# Altium schematic sheet Control.SchDoc
size A4
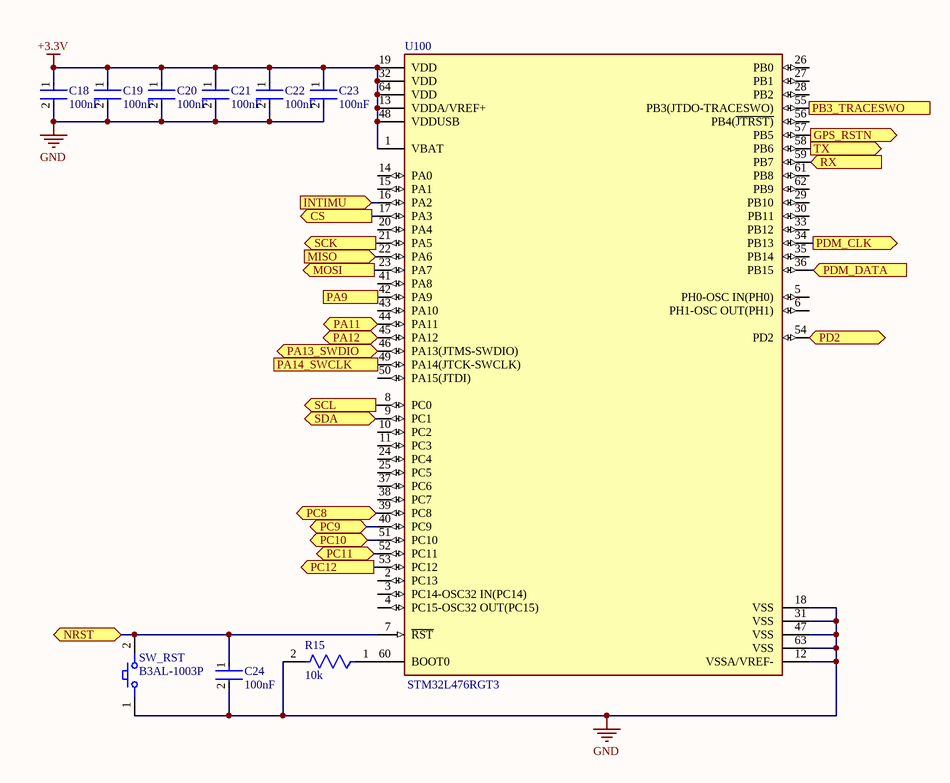
[diagram p0: Control.SchDoc]

## Parts
C18  100nF  [FP-GCG188-0_2-IPC_B]
C19  100nF  [FP-GCG188-0_2-IPC_B]
C20  100nF  [FP-GCG188-0_2-IPC_B]
C21  100nF  [FP-GCG188-0_2-IPC_B]
C22  100nF  [FP-GCG188-0_2-IPC_B]
C23  100nF  [FP-GCG188-0_2-IPC_B]
C24  100nF  [FP-GCG188-0_2-IPC_B]
R15  10k  [FP-CRCW0603-HPe3-MFG]
SW_RST  B3AL-1003P  [FP-B3AL-1003P-MFG]
U100  STM32L476RGT3  [FP-LQFP64-5W-IPC_C]

## Ports
CS (out), GPS_RSTN (out), INTIMU (in), MISO (in), MOSI (out), NRST (bidir), PA9 (in), PA11 (bidir), PA12 (bidir), PA13_SWDIO (bidir), PA14_SWCLK (in), PB3_TRACESWO (out), PC8 (bidir), PC9 (bidir), PC10 (bidir), PC11 (bidir), PC12 (out), PD2 (bidir), PDM_CLK (out), PDM_DATA (in), RX (in), SCK (out), SCL (out), SDA (bidir), TX (out)

## Nets
+3.3V: C18.1 C19.1 C20.1 C21.1 C22.1 C23.1 U100.1(VBAT) U100.13(VDDA/VREF+) U100.19(VDD) U100.32(VDD) U100.48(VDDUSB) U100.64(VDD)
GND: C18.2 C19.2 C20.2 C21.2 C22.2 C23.2 C24.2 R15.2 SW_RST.1 U100.12(VSSA/VREF-) U100.18(VSS) U100.31(VSS) U100.47(VSS) U100.63(VSS)
CS: U100.17(PA3) ; port CS
GPS_RSTN: U100.57(PB5) ; port GPS_RSTN
INTIMU: U100.16(PA2) ; port INTIMU
MISO: U100.22(PA6) ; port MISO
MOSI: U100.23(PA7) ; port MOSI
NRST: C24.1 SW_RST.2 U100.7(~{RST}) ; port NRST
PA9: U100.42(PA9) ; port PA9
PA11: U100.44(PA11) ; port PA11
PA12: U100.45(PA12) ; port PA12
PA13_SWDIO: U100.46(PA13(JTMS-SWDIO)) ; port PA13_SWDIO
PA14_SWCLK: U100.49(PA14(JTCK-SWCLK)) ; port PA14_SWCLK
PB3_TRACESWO: U100.55(PB3(JTDO-TRACESWO)) ; port PB3_TRACESWO
PC8: U100.39(PC8) ; port PC8
PC9: U100.40(PC9) ; port PC9
PC10: U100.51(PC10) ; port PC10
PC11: U100.52(PC11) ; port PC11
PC12: U100.53(PC12) ; port PC12
PD2: U100.54(PD2) ; port PD2
PDM_CLK: U100.34(PB13) ; port PDM_CLK
PDM_DATA: U100.36(PB15) ; port PDM_DATA
RX: U100.59(PB7) ; port RX
SCK: U100.21(PA5) ; port SCK
SCL: U100.8(PC0) ; port SCL
SDA: U100.9(PC1) ; port SDA
TX: U100.58(PB6) ; port TX
NetR15_1: R15.1 U100.60(BOOT0)

Not connected (* = marked no-connect by the designer): U100 2(PC13) 3(PC14-OSC32_IN(PC14)) 4(PC15-OSC32_OUT(PC15)) 5(PH0-OSC_IN(PH0)) 6(PH1-OSC_OUT(PH1)) 10(PC2) 11(PC3) 14(PA0) 15(PA1) 20(PA4) 24(PC4) 25(PC5) 26(PB0) 27(PB1) 28(PB2) 29(PB10) 30(PB11) 33(PB12) 35(PB14) 37(PC6) 38(PC7) 41(PA8) 43(PA10) 50(PA15(JTDI)) 56(PB4(~{JTRST)}) 61(PB8) 62(PB9)

## Notes on the sheet
- Title:
- Drawn By:
- Page Contents:
- Checked By:
- Size:
- Date:
- File:
- License:
- Email:
- A4
- Number:
- Time:
- Revision:
- Sheet
- Website:
- of

## Library data of the parts
C18-C24 = CMP-06035-011350-1: AgPd Termination Conductive Glue Mounting Chip Multilayer Ceramic Capacitors for Automotive 0.1uF with 20% as tolerance, 50V X8R 15%, 0603 Package
R15 = CMP-2000-03835-2: RES SMD 10K OHM 1% 1/3W 0603; Resistance: 10kR; Voltage Rating (DC): 75V; Max Power Dissipation: 250mW; Temperature Coefficient: 100ppm/°C; Case Code (Metric): 1608; Features: Automotive AEC-Q200; Termination: SMD/SMT; Number of Terminations: 2; Case Code (Imperial): 0603; Tolerance: 1%; Depth: 0.85mm; Package Quantity: 10; Length: 1.6mm; Packaging: Tape and Reel; Contact Plating: Tin; Radiation Hardening: No; Case/Package: 0603; Composition: Thick Film; Voltage Rating: 75V; Weight: 7.1E-05oz; Max Operating Temperature: 155°C; Lead Free: Lead Free; Width: 0.033inch; Power Rating: 250mW; Min Operating Temperature: -55°C; Military Standard: Not; Height: 0.45mm
SW_RST = CMP-08834-000018-1: SWITCH TACTILE SPST-NO 0.05A 16V; Contact Resistance: 100mR; Illumination Type: Non-Illuminated; Electrical Life: 1000000Cycles; Switch Function: Off-Mom; Switch Travel: 1.3mm; Contact Current Rating: 50mA; Actuator Color: White; Operating Force: 3.5N; Throw Configuration: SPST; Package Quantity: 1; Orientation: Straight; Radiation Hardening: No; Packaging: Tape and Reel; Max Voltage Rating (DC): 16V; Mechanical Life: 1000000Cycles; Min Operating Temperature: -40°C; Depth: 6.6mm; Voltage Rating (DC): 16V; Contact Plating: Silver; Mount: Surface Mount; Series: B3AL; Termination: SMD/SMT; Max Current Rating: 50mA; RoHS Compliant: Yes; Max Operating Temperature: 90°C; Current Rating: 50mA; Length: 6.9mm; Weight: 0.18g
U100 = CMP-12105-000133-1: IC MCU 32BIT 1MB FLASH 64LQFP; Core Architecture: ARM; Frequency: 80MHz; Number of I/Os: 51; Peripherals: Brown-out Detect/Reset; Interface: I2C; Oscillator Type: Internal; Case/Package: LQFP; Memory Type: FLASH; Packaging: Tray; Min Operating Temperature: -40°C; Memory Size: 1MB; Max Operating Temperature: 125°C